# EAGLE design soundMeter_sm (EAGLE 6.3)
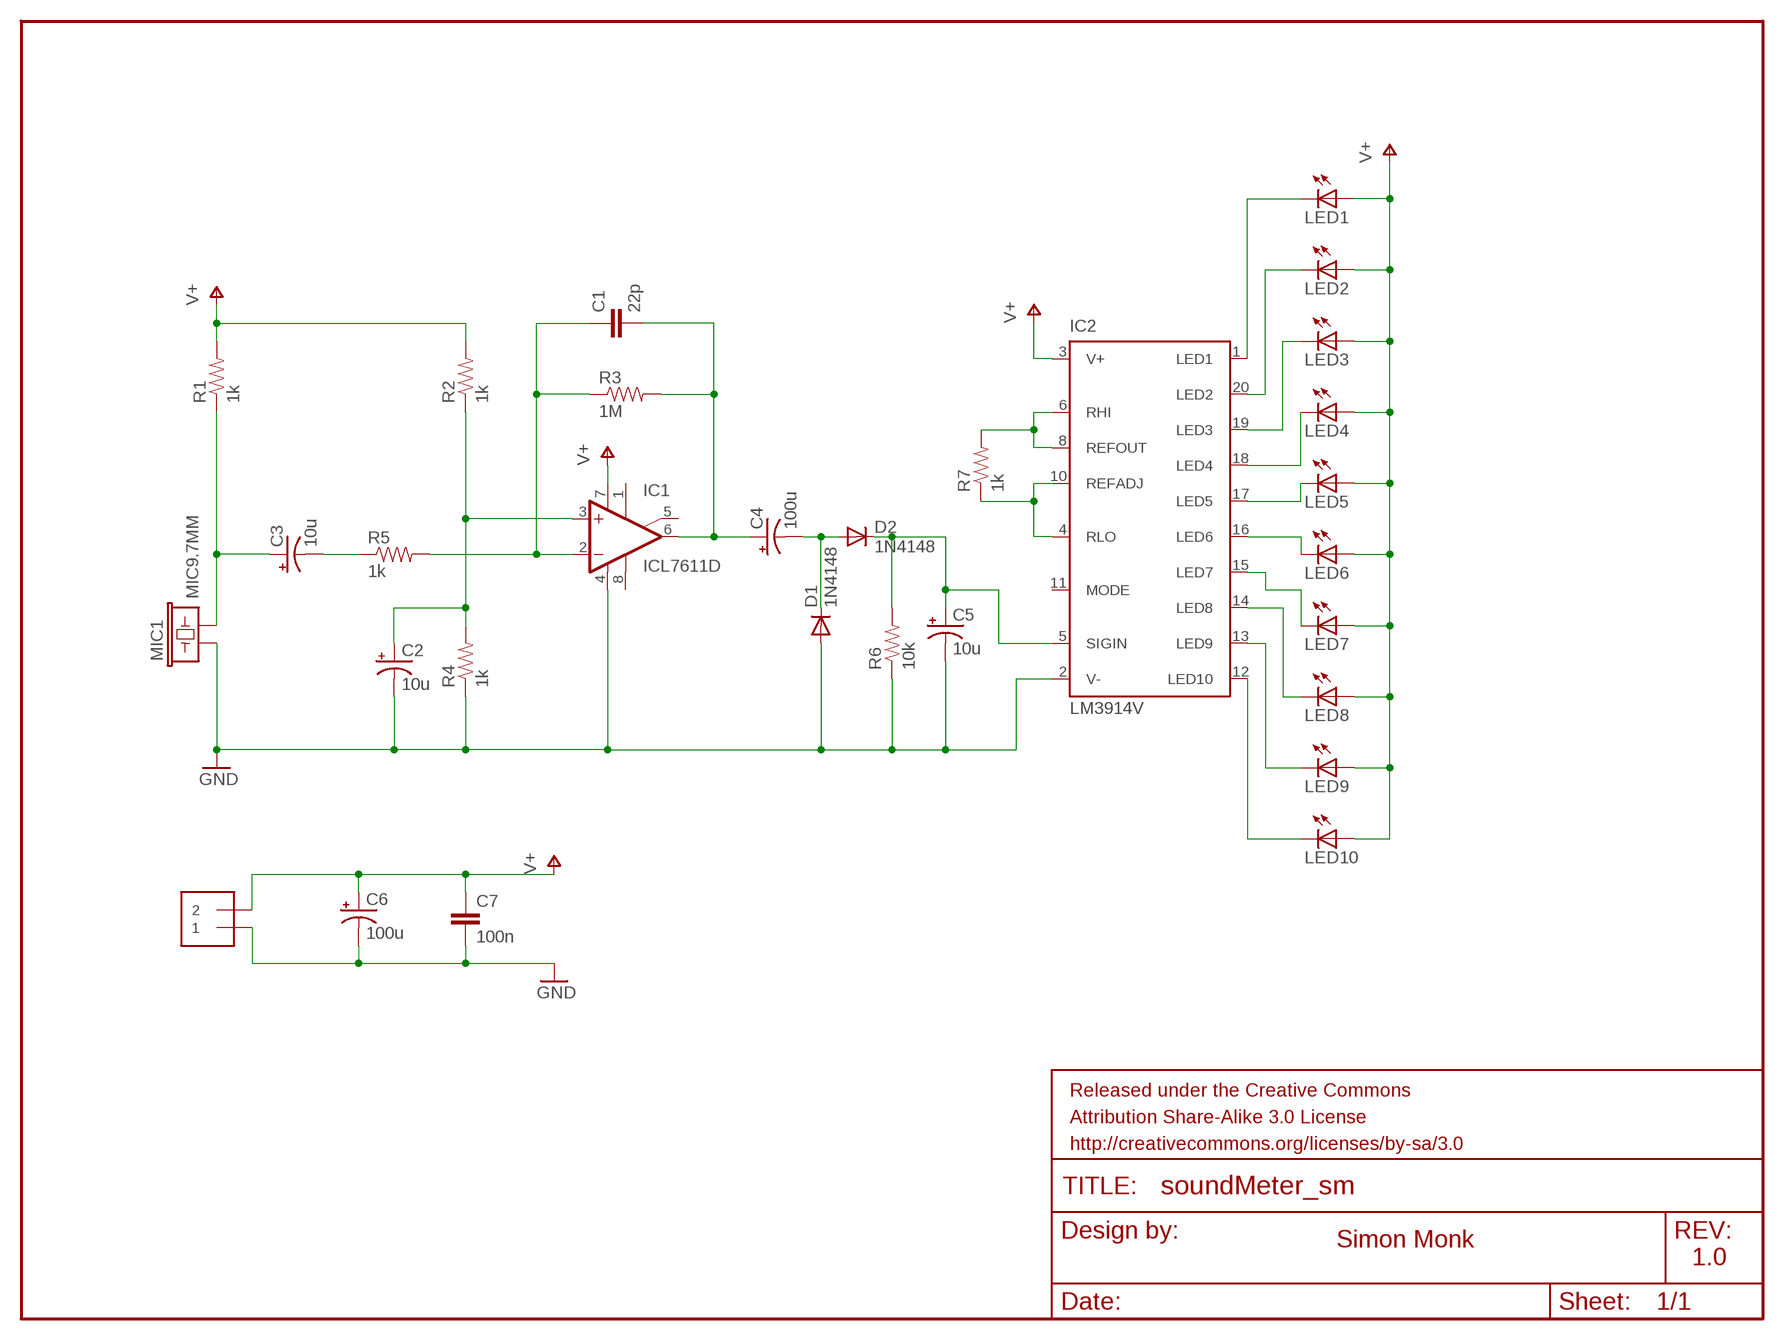
[diagram p0: schematic, sheet 1]

## Parts
C1  22p  CAP1206  [1206]
C2  10u  CAP_POLC  [PANASONIC_C]
C3  10u  CAP_POLC  [PANASONIC_C]
C4  100u  CAP_POLD  [PANASONIC_D]
C5  10u  CAP_POLC  [PANASONIC_C]
C6  100u  CAP_POLD  [PANASONIC_D]
C7  100n  CAP1206  [1206]
D1  1N4148  DIODESOD  [SOD-323]
D2  1N4148  DIODESOD  [SOD-323]
FRAME1  FRAME-LETTER  [CREATIVE_COMMONS]
IC1  ICL7611D  [SO08]
IC2  LM3914V  [PLCC20S]
J1  1X2-3.5MM  [1X2-3.5MM]
LED1  LED1206  [LED-1206]
LED2  LED1206  [LED-1206]
LED3  LED1206  [LED-1206]
LED4  LED1206  [LED-1206]
LED5  LED1206  [LED-1206]
LED6  LED1206  [LED-1206]
LED7  LED1206  [LED-1206]
LED8  LED1206  [LED-1206]
LED9  LED1206  [LED-1206]
LED10  LED1206  [LED-1206]
MIC1  MIC9.7MM  [MIC-9.7MM]
R1  1k  RESISTOR1206  [1206]
R2  1k  RESISTOR1206  [1206]
R3  1M  RESISTOR1206  [1206]
R4  1k  RESISTOR1206  [1206]
R5  1k  RESISTOR1206  [1206]
R6  10k  RESISTOR1206  [1206]
R7  1k  RESISTOR1206  [1206]

## Nets
GND [supply]: C2.- C5.- C6.- C7.2 D1.2(A) IC1.4(V-) IC2.2(V-) J1.1 MIC1.1 R4.1 R6.1
N$1: C4.- D1.1(C) D2.2(A)
N$2: C3.+ MIC1.2 R1.1
N$3: C5.+ D2.1(C) IC2.5(SIGIN) R6.2
N$4: C2.+ IC1.3(+IN) R2.1 R4.2
N$5 [supply]: C3.- R5.1
N$6: C1.1 IC1.2(-IN) R3.1 R5.2
N$7: C1.2 C4.+ IC1.6(OUT) R3.2
N$8: IC2.12(LED10) LED10.C
N$9: IC2.13(LED9) LED9.C
N$10: IC2.14(LED8) LED8.C
N$11: IC2.15(LED7) LED7.C
N$12: IC2.16(LED6) LED6.C
N$13: IC2.17(LED5) LED5.C
N$14: IC2.18(LED4) LED4.C
N$15: IC2.19(LED3) LED3.C
N$16: IC2.20(LED2) LED2.C
N$17: IC2.1(LED1) LED1.C
N$18: IC2.4(RLO) IC2.10(REFADJ) R7.1
N$19: IC2.6(RHI) IC2.8(REFOUT) R7.2
V+ [supply]: C6.+ C7.1 IC1.7(V+) IC2.3(V+) J1.2 LED1.A LED2.A LED3.A LED4.A LED5.A LED6.A LED7.A LED8.A LED9.A LED10.A R1.2 R2.2
Unconnected: IC1.1(ON1) IC1.5(ON2) IC1.8(OPT) IC2.11(MODE)

## Notes on the sheet
- Simon Monk
- 1.0

## Library data of the parts
C1 C7 = SparkFun-Capacitors:CAP: Capacitor Standard 0603 ceramic capacitor, and 0.1" leaded capacitor.
C2-C6 = SparkFun-Capacitors:CAP_POL: Capacitor Polarized These are standard SMD and PTH capacitors. Normally 10uF, 47uF, and 100uF in electrolytic and tantalum varieties. Always verify the external diameter of the through hole cap, it varies with capacity, voltage, and manufacturer. The EIA devices should be standard.
D1 D2 = SparkFun-DiscreteSemi:DIODE: Diode These are standard reverse protection diodes and small signal diodes. SMA package can handle up to about 1A. SOD-323 can handle about 200mA. What the SOD-323 package when ordering, there are some mfgs out there that are 5-pin packages.
FRAME1 = SparkFun-Aesthetics:FRAME-LETTER: Schematic Frame Standard 8.5x11 US Letter frame
IC1 = linear:ICL7611: OP AMP
IC2 = national-semiconductor:LM391: Dot/Bar Display Driver Source: Data sheet LM3915 <http://www.national.com/ds/LM/LM3915.pdf> Data sheet LM3914 <http://www.national.com/ds/LM/LM3914.pdf>
J1 = adafruit:1X2: 3.5mm Terminal block http://www.ladyada.net/library/pcb/eaglelibrary.html
LED1-LED10 = LilyPad-Wearables:LED: LEDs Standard schematic elements and footprints for 5mm, 3mm, 1206, and 0603 sized LEDs. 5mm - Spark Fun Electronics SKU : Comp-SBL
MIC1 = SparkFun-Sensors:MIC: Omni-directional electret microphone. 9.7mm standard diameter.
R1-R7 = SparkFun-Passives:RESISTOR: Resistor Basic schematic elements and footprints for 0603, 1206, and PTH resistors.

## Net classes
0 default: width 0.254 mm, clearance 0.254 mm
1 supply: width 0.508 mm, clearance 0.508 mm

## Board
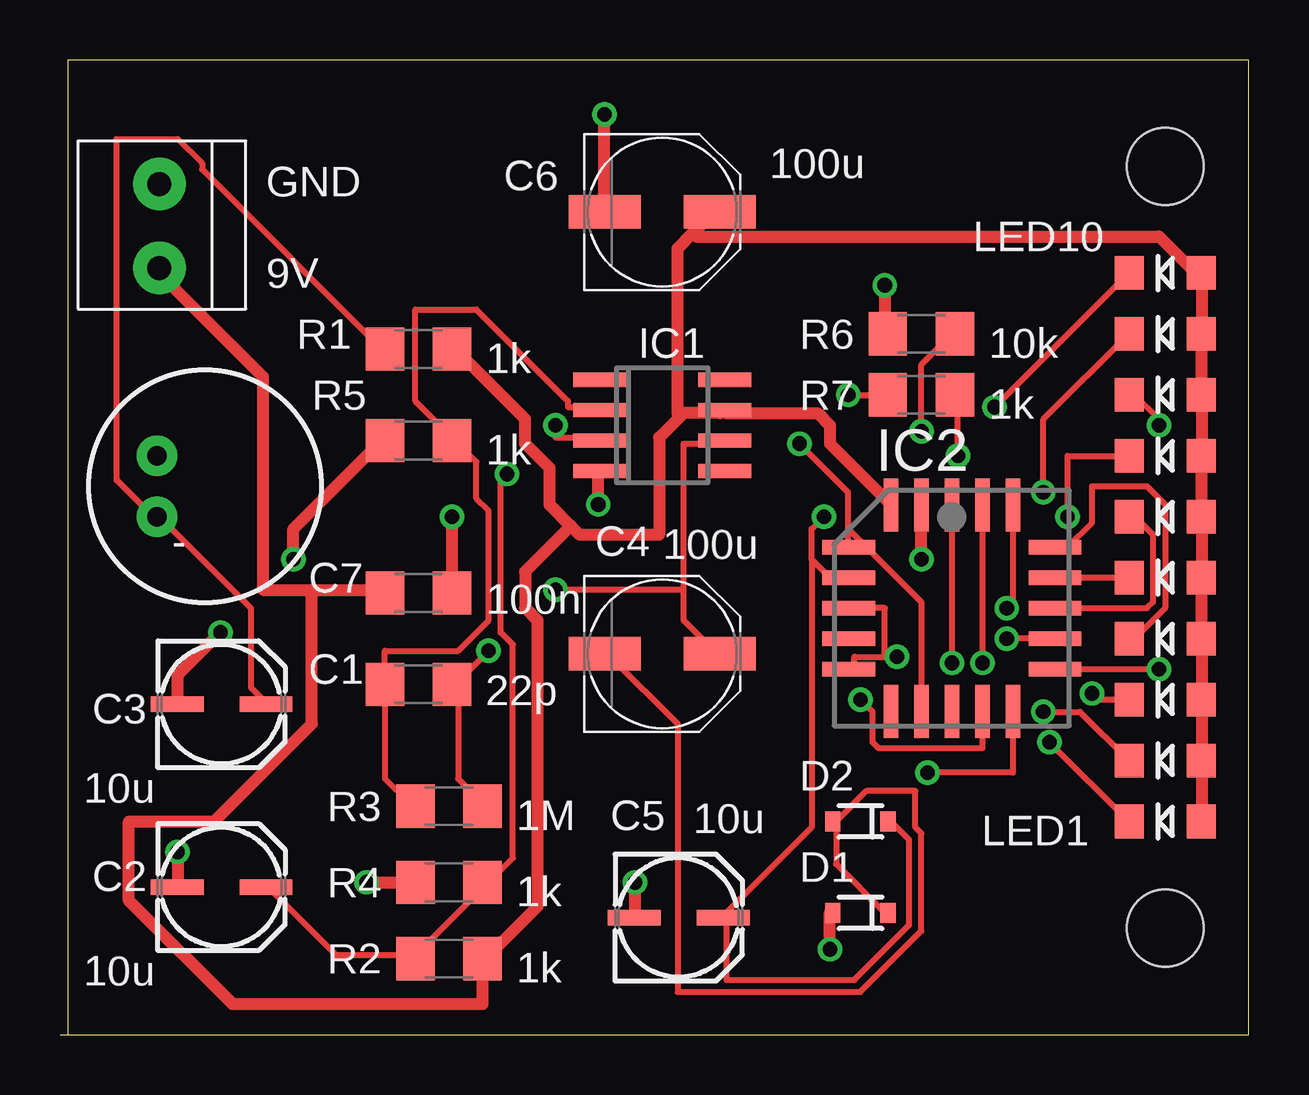
[diagram p1: board, top side]
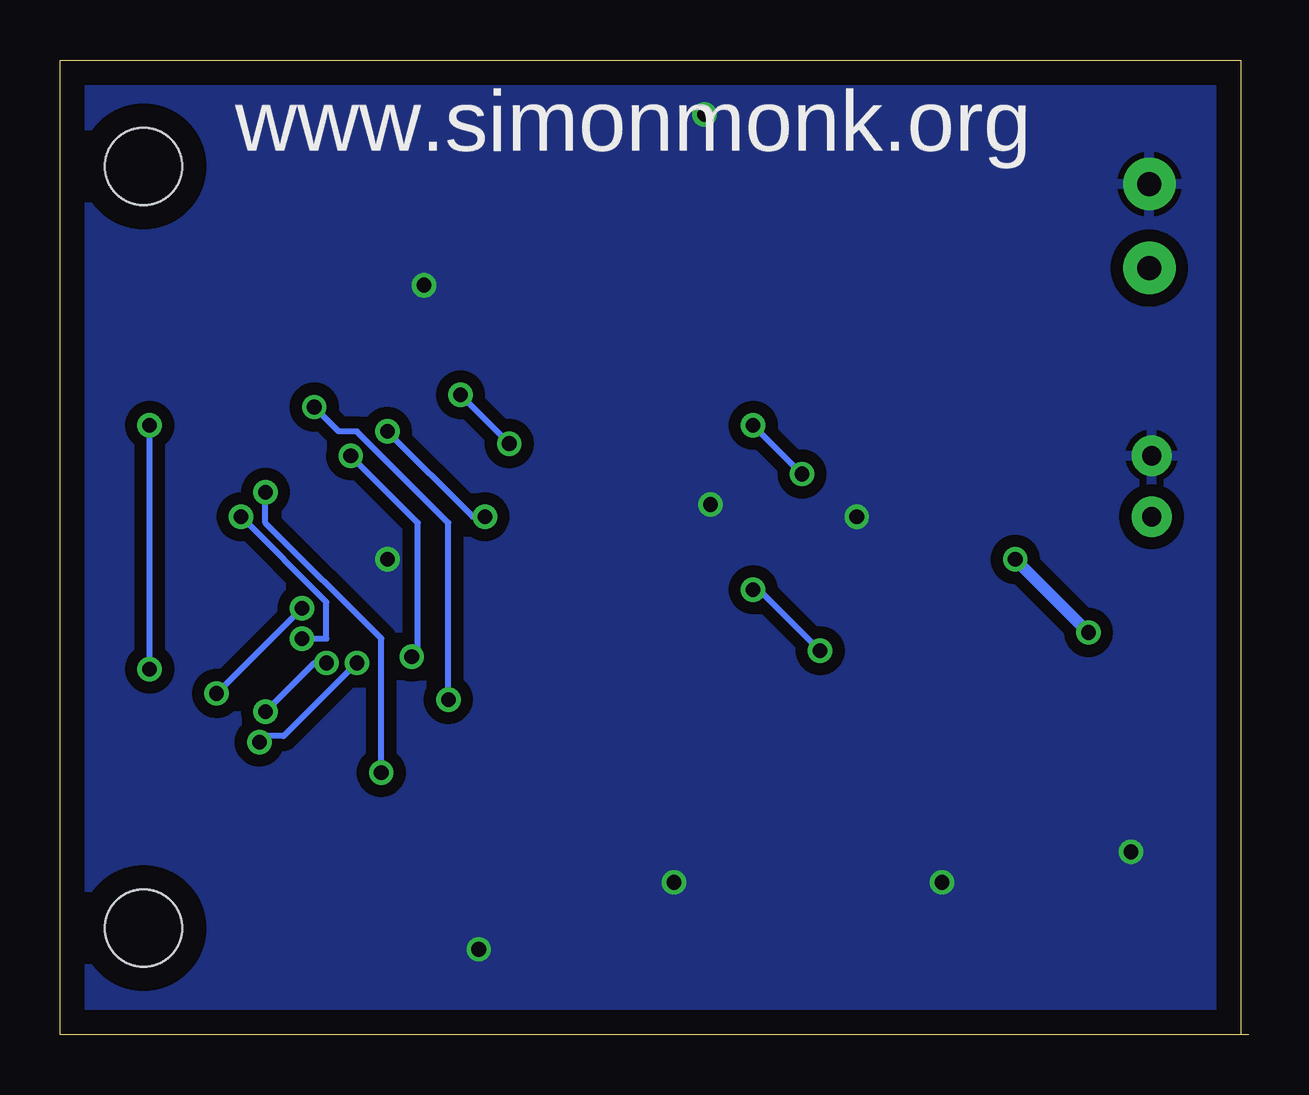
[diagram p2: board, bottom side, seen from below]

Size 49.53 x 40.64 mm. Coordinates in mm from the lower left corner, seen from the top.
Outline: 49.53,0.01 49.53,40.64 0.33,40.64 0.33,0.01
Outline: 0,0.01 49.53,0
Copper layers (1*16): Top 0.035mm / dielectric 1.5mm / Bottom 0.035mm
Design rules "default": minimum track width 10mil, minimum drill 24mil, track to track 8mil, track to pad 8mil, pad to pad 8mil, via to via 8mil, smd to smd 8mil, copper to edge 40mil, drill to drill 8mil, minimum pad ring 10mil, minimum via ring 8mil, stop-mask expansion 4mil, vias tented up to drill 0mil, thermal gap 10mil
Holes 3.2 mm at 46.05,36.2 46.05,4.46

### Footprints (pad centres in the part's own frame; a part is rotated, then mirrored left to right if it is on the bottom)
1206 = smd 1.6 x 1.8: 1 -1.4,0; 2 1.4,0
PANASONIC_C = smd 2.2 x 0.65: + 1.9,-0.2; - -1.8,-0.2
PANASONIC_D = smd 3 x 1.4: + 2.4,0; - -2.4,0
SOD-323 = smd 0.63 x 0.83: 1 -1.15,0; 2 1.15,0
SO08 = smd 0.6 x 2.2: 1 -1.905,-2.6; 2 -0.635,-2.6; 3 0.635,-2.6; 4 1.905,-2.6; 5 1.905,2.6; 6 0.635,2.6; 7 -0.635,2.6; 8 -1.905,2.6
PLCC20S = smd 0.6 x 2.2: 1 0,4.3; 2 -1.27,4.3; 3 -2.54,4.3; 9 -2.54,-4.3; 10 -1.27,-4.3; 11 0,-4.3; 12 1.27,-4.3; 13 2.54,-4.3; 19 2.54,4.3; 20 1.27,4.3 | smd 2.2 x 0.6: 4 -4.3,2.54; 5 -4.3,1.27; 6 -4.3,0; 7 -4.3,-1.27; 8 -4.3,-2.54; 14 4.3,-2.54; 15 4.3,-1.27; 16 4.3,0; 17 4.3,1.27; 18 4.3,2.54
1X2-3.5MM = drill 1 pad 2.184: 1 1.8,0; 2 -1.7,0
LED-1206 = smd 1.2 x 1.4: A -1.5,0; C 1.5,0
MIC-9.7MM = drill 0.8 pad 1.676: 1 -2,1.27; 2 -2,-1.27

### Placement (x,y rotation side)
C1  14.94,14.62 0 top
C2  6.68,6.36 0 top
C3  6.68,13.98 0 top
C4  25.09,15.88 0 top
C5  25.73,5.09 0 top
C6  25.09,34.3 0 top
C7  14.94,18.43 0 top
D1  33.35,5.09 180 top
D2  33.35,8.9 180 top
FRAME1  -77.14,24.14 0 top  (outside the outline)
IC1  25.09,25.41 270 top
IC2  37.16,17.79 0 top
J1  4.14,33.66 90 top
LED1  46.05,8.9 180 top
LED2  46.05,11.44 180 top
LED3  46.05,13.98 180 top
LED4  46.05,16.52 180 top
LED5  46.05,19.06 180 top
LED6  46.05,21.6 180 top
LED7  46.05,24.14 180 top
LED8  46.05,26.68 180 top
LED9  46.05,29.22 180 top
LED10  46.05,31.76 180 top
MIC1  6.04,22.87 0 top
R1  14.94,28.59 0 top
R2  16.2,3.18 0 top
R3  16.2,9.54 0 top
R4  16.2,6.36 0 top
R5  14.94,24.78 0 top
R6  35.89,29.22 0 top
R7  35.89,26.68 0 top

### Tracks (layer width: path | path; a pad name or v marks a point on that pad's centre or on a via)
GND  (via drill 0.61)
  Top 0.508: v32.08,3.57 32.08,5.09 D1.2 | v22.68,38.36 22.68,34.3 C6.- | v12.78,6.36 R4.1 | v16.33,21.6 16.33,18.55 C7.2 | v34.37,31.25 34.37,29.22 R6.1 | v4.9,7.63 4.9,6.36 C2.- | v23.95,6.36 23.95,5.09 C5.- | v22.43,22.11 22.43,23.38 IC1.4 | v35.89,19.82 IC2.2
  pour Bottom: 0.33,40.65 49.86,40.65 49.86,0.65 0.33,0.65
N$1
  Top 0.254: 32.33,8.9 32.33,7.12 34.37,5.09 D1.1 | 32.33,8.9 33.6,10.17 35.64,10.17 35.64,8.65 35.89,8.39 35.89,4.33 33.35,1.79 25.73,1.79 25.73,12.96 22.94,15.76 C4.- | 32.33,8.9 D2.2
N$2
  Top 0.254: R1.1 13.28,28.71 5.92,36.08 5.92,36.33 4.9,37.35 2.36,37.35 2.36,23.12 3.89,21.6 MIC1.2 4.14,21.6 7.95,17.79 7.95,14.49 8.46,13.98 C3.+
N$3  (via drill 0.61)
  Top 0.254: D2.1 34.62,8.9 35.38,8.14 35.38,4.58 33.1,2.3 27.76,2.3 27.76,4.84 C5.+ 27.76,5.09 31.32,8.65 31.32,19.82 | v35.89,25.16 35.89,27.95 37.16,29.22 R6.2 | v31.83,21.6 31.32,21.09 31.32,19.82 | 31.32,19.82 32.08,19.06 IC2.5
  Bottom 0.254: v35.89,25.16 32.33,21.6 v31.83,21.6
N$4  (via drill 0.61)
  Top 0.254: C2.+ 8.71,6.11 11.51,3.31 14.55,3.31 R2.1 14.81,3.31 17.6,6.11 R4.2 17.86,6.36 18.87,7.38 18.87,16.27 18.36,16.77 18.36,23.12 v18.62,23.38 | v20.65,25.41 20.65,24.9 22.43,24.9 IC1.3
  Bottom 0.254: v18.62,23.38 v20.65,25.41
N$5  (via drill 0.61)
  Top 0.508: v9.73,19.82 9.73,21.09 13.28,24.65 R5.1 | v6.68,16.77 4.9,15 4.9,13.98 C3.-
  Bottom 0.508: v6.68,16.77 v9.73,19.82
N$6
  Top 0.254: R3.1 14.55,9.66 13.54,10.68 13.54,14.49 C1.1 13.54,14.74 13.54,16.01 16.59,16.01 17.86,17.28 17.86,21.85 17.35,22.36 17.35,23.89 16.59,24.65 R5.2 16.33,24.9 14.81,26.43 14.81,30.24 17.35,30.24 21.16,26.43 21.16,26.17 22.43,26.17 IC1.2
N$7  (via drill 0.61)
  Top 0.254: R3.2 17.6,9.66 16.59,10.68 16.59,14.49 C1.2 16.59,14.74 v17.86,16.01 | 25.98,18.55 25.98,17.28 27.25,16.01 C4.+ | 25.98,18.55 25.98,24.65 27.51,24.65 IC1.6 | 25.98,18.55 v20.65,18.55
  Bottom 0.254: v17.86,16.01 20.4,18.55 v20.65,18.55
N$8  (via drill 0.61)
  Top 0.254: v38.94,26.17 44.53,31.76 LED10.C | v33.35,13.98 33.86,13.47 33.86,12.2 34.11,11.95 38.43,11.95 IC2.12
  Bottom 0.254: v38.94,26.17 37.92,25.16 37.16,25.16 33.35,21.35 v33.35,13.98
N$9  (via drill 0.61)
  Top 0.254: v40.97,22.62 40.97,25.66 44.53,29.22 LED9.C | v36.14,10.93 39.7,10.93 IC2.13
  Bottom 0.254: v40.97,22.62 40.97,21.35 36.14,16.52 v36.14,10.93
N$10  (via drill 0.61)
  Top 0.254: v45.8,25.41 45.8,25.66 44.78,26.68 LED8.C | IC2.14 v45.8,15.25
  Bottom 0.254: v45.8,15.25 v45.8,25.41
N$11  (via drill 0.61)
  Top 0.254: LED7.C 41.99,24.14 v41.99,21.6 | IC2.15 v39.45,16.52
  Bottom 0.254: v41.99,21.6 38.43,18.04 38.43,16.52 v39.45,16.52
N$12
  Top 0.254: IC2.16 45.29,17.79 45.54,18.04 45.54,20.84 44.78,21.6 LED6.C
N$13
  Top 0.254: IC2.17 LED5.C
N$14
  Top 0.254: IC2.18 41.99,20.33 43,21.35 43,22.87 45.29,22.87 46.05,22.11 46.05,17.79 44.78,16.52 LED4.C
N$15  (via drill 0.61)
  Top 0.254: LED3.C 43,13.98 v43,14.23 | v39.45,17.79 39.7,18.04 IC2.19
  Bottom 0.254: v39.45,17.79 v43,14.23
N$16  (via drill 0.61)
  Top 0.254: v40.97,13.47 42.49,13.47 44.53,11.44 LED2.C | IC2.20 v38.43,15.5
  Bottom 0.254: v40.97,13.47 38.94,15.5 v38.43,15.5
N$17  (via drill 0.61)
  Top 0.254: v41.22,12.2 44.53,8.9 LED1.C | IC2.1 v37.16,15.5
  Bottom 0.254: v41.22,12.2 40.97,12.46 40.21,12.46 v37.16,15.5
N$18  (via drill 0.61)
  Top 0.254: v32.84,26.68 R7.1 | v30.81,24.65 32.84,22.62 32.84,21.09 | 32.84,21.09 32.84,20.33 IC2.4 | IC2.10 35.89,18.04 32.84,21.09
  Bottom 0.254: v30.81,24.65 v32.84,26.68
N$19  (via drill 0.61)
  Top 0.254: v37.41,24.14 37.41,26.68 R7.2 | 34.37,15.76 33.1,15.76 33.1,15.25 IC2.8 | 34.37,15.76 v34.87,15.76 | IC2.6 34.37,17.79 34.37,15.76
  Bottom 0.254: v37.41,24.14 34.62,21.35 34.62,15.76 v34.87,15.76
V+
  Top 0.508: 10.49,18.55 8.46,18.55 8.46,27.44 4.14,31.76 J1.2 | 10.49,18.55 13.28,18.55 C7.1 | 47.57,29.22 47.57,31.76 LED10.A 47.32,31.76 45.8,33.28 26.49,33.28 26.36,33.41 | 47.57,26.68 47.57,24.14 | 47.57,21.6 47.57,19.06 | 47.57,11.44 47.57,8.9 LED1.A | 47.57,16.52 47.57,13.98 | 47.57,13.98 47.57,11.44 | 47.57,11.44 LED2.A | 47.57,13.98 LED3.A | 47.57,16.52 47.57,19.06 | 47.57,19.06 LED5.A | 47.57,16.52 LED4.A | 47.57,21.6 47.57,24.14 | 47.57,24.14 LED7.A | 47.57,21.6 LED6.A | 47.57,26.68 47.57,29.22 | 47.57,29.22 LED9.A | 47.57,26.68 LED8.A | 21.28,21.22 21.67,20.84 24.97,20.84 24.97,24.9 25.86,25.79 | 21.28,21.22 20.4,22.11 20.4,23.63 19.38,24.65 19.38,25.66 16.59,28.46 R1.2 | 25.86,25.79 25.98,25.92 27.51,25.92 IC1.7 27.76,25.92 31.57,25.92 32.08,25.41 32.08,24.65 34.62,22.11 IC2.3 | 21.28,21.22 19.38,19.31 19.38,17.79 19.89,17.28 19.89,5.34 17.86,3.31 R2.2 17.6,3.06 17.6,1.28 7.19,1.28 2.87,5.6 2.87,8.9 6.43,8.9 10.49,12.96 10.49,18.55 | 26.36,33.41 25.73,32.78 25.73,25.92 25.86,25.79 | 26.36,33.41 27.25,34.3 C6.+

### Text on the board
tPlace: GND | 9V
bPlace: www.simonmonk.org